# EAGLE design tractor_panel_1v0 (EAGLE 9.5.2)
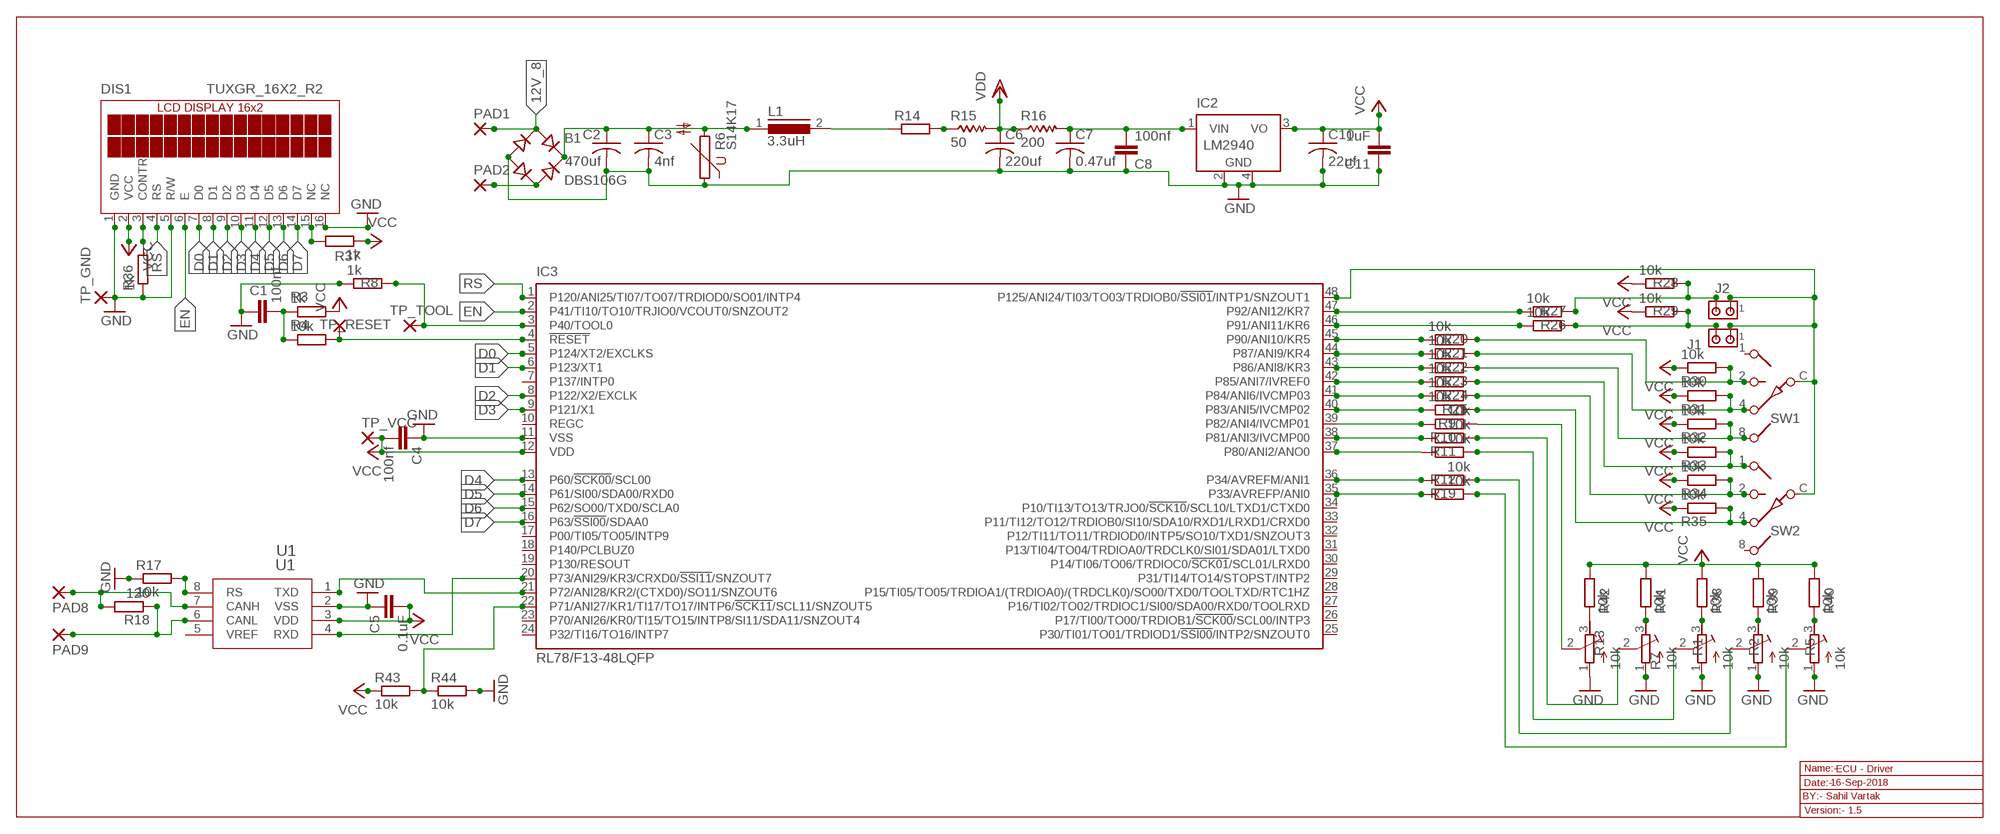
[diagram p0: schematic, sheet 1]

## Parts
B1  DBS106G  [DBS]
C1  100nf  CC0603  [C0603]
C2  470uf  C-US050-075X075  [C050-075X075]
C3  4nf  C-US050-045X075  [C050-045X075]
C4  100nf  CC0603  [C0603]
C5  0.1uF  CC0603  [C0603]
C6  220uf  C-US025-025X050  [C025-025X050]
C7  0.47uf  C-US025-025X050  [C025-025X050]
C8  100nf  CC0603  [C0603]
C10  22uf  C-US025-025X050  [C025-025X050]
C11  1uF  CC0603  [C0603]
DIS1  TUXGR_16X2_R2  [TUXGR_16X2_R2]
IC2  LM2940  LM2936MP-3.0  [SOT223]
IC3  RL78/F13-48LQFP  [P-LFQFP48-7X7]
J1  MTA02-156  [1X2MTA]
J2  MTA02-156  [1X2MTA]
L1  3.3uH  82114R  [82114R]
PAD1  2,54/1,1  [2,54/1,1]
PAD2  2,54/1,1  [2,54/1,1]
PAD8  2,54/1,1  [2,54/1,1]
PAD9  2,54/1,1  [2,54/1,1]
R1  10k  R-TRIMM3296W  [RTRIM3296W]
R2  10k  R-TRIMM3296W  [RTRIM3296W]
R3  1k  RR0603  [R0603]
R4  10k  RR0603  [R0603]
R5  10k  R-TRIMM3296W  [RTRIM3296W]
R6  S14K17  [S14K17]
R7  10k  R-TRIMM3296W  [RTRIM3296W]
R8  1k  RR0603  [R0603]
R9  10k  RR0603  [R0603]
R10  10k  RR0603  [R0603]
R11  10k  RR0603  [R0603]
R12  10k  RR0603  [R0603]
R13  10k  R-TRIMM3296W  [RTRIM3296W]
R14  R-EU_R0603  [R0603]
R15  50  R-US_WSC2515  [WSC2515]
R16  200  R-US_WSC2515  [WSC2515]
R17  10k  RR0603  [R0603]
R18  120  RR0603  [R0603]
R19  10k  RR0603  [R0603]
R20  10k  RR0603  [R0603]
R21  10k  RR0603  [R0603]
R22  10k  RR0603  [R0603]
R23  10k  RR0603  [R0603]
R24  10k  RR0603  [R0603]
R25  10k  RR0603  [R0603]
R26  10k  RR0603  [R0603]
R27  10k  RR0603  [R0603]
R28  10k  RR0603  [R0603]
R29  10k  RR0603  [R0603]
R30  10k  RR0603  [R0603]
R31  10k  RR0603  [R0603]
R32  10k  RR0603  [R0603]
R33  10k  RR0603  [R0603]
R34  10k  RR0603  [R0603]
R35  10k  RR0603  [R0603]
R36  1k  RR0603  [R0603]
R37  1k  RR0603  [R0603]
R38  10k  RR0603  [R0603]
R39  10k  RR0603  [R0603]
R40  10k  RR0603  [R0603]
R41  10k  RR0603  [R0603]
R42  10k  RR0603  [R0603]
R43  10k  RR0603  [R0603]
R44  10k  RR0603  [R0603]
SW1  SW-C10  [SW-C10]
SW2  SW-C10  [SW-C10]
TP_GND  1,6/0,8  [1,6/0,8]
TP_RESET  1,6/0,8  [1,6/0,8]
TP_TOOL  1,6/0,8  [1,6/0,8]
TP_VCC  1,6/0,8  [1,6/0,8]
U1  U1  MCP2551-I/SNSOIC8-N_MC-M  [SOIC8-N_MC-M]

## Nets
12V_8: B1.AC1 PAD1.1(P)
D0: DIS1.7(D0) IC3.5(P124/XT2/EXCLKS)
D1: DIS1.8(D1) IC3.6(P123/XT1)
D2: DIS1.9(D2) IC3.8(P122/X2/EXCLK)
D3: DIS1.10(D3) IC3.9(P121/X1)
D4: DIS1.11(D4) IC3.13(P60/!SCK00!/SCL00)
D5: DIS1.12(D5) IC3.14(P61/SI00/SDA00/RXD0)
D6: DIS1.13(D6) IC3.15(P62/SO00/TXD0/SCLA0)
D7: DIS1.14(D7) IC3.16(P63/!SSI00!/SDAA0)
EN: DIS1.6(E) IC3.2(P41/TI10/TO10/TRJIO0/VCOUT0/SNZOUT2)
GND: B1.- C1.1 C2.2 C3.2 C4.1 C5.1 C6.2 C7.2 C8.1 C10.2 C11.1 DIS1.1(GND) DIS1.5(R/W) DIS1.16(NC) IC2.2(GND) IC2.4(GND) IC3.11(VSS) R1.1(A) R2.1(A) R5.1(A) R6.1 R7.1(A) R8.1 R13.1(A) R17.1 R36.1 R44.2 TP_GND.1(P) U1.2(VSS)
N$1: B1.AC2 PAD2.1(P)
N$2: IC3.22(P71/ANI27/KR1/TI17/TO17/INTP6/!SCK11!/SCL11/SNZOUT5) R43.2 R44.1
N$3: L1.2 R14.1
N$4: R5.2(S) R19.1
N$5: R2.2(S) R12.1
N$6: IC3.45(P90/ANI10/KR5) R20.1
N$7: C7.1 C8.2 IC2.1(VIN) R16.2
N$8: DIS1.3(CONTR) R36.2
N$9: DIS1.15(NC) R37.2
N$10: IC3.46(P91/ANI11/KR6) R26.1
N$11: IC3.47(P92/ANI12/KR7) R27.1
N$12: IC3.44(P87/ANI9/KR4) R21.1
N$13: R1.3(E) R38.1
N$14: R2.3(E) R39.1
N$15: R14.2 R15.1
N$16: R5.3(E) R40.1
N$17: R7.3(E) R41.1
N$18: R13.3(E) R42.1
N$19: IC3.48(P125/ANI24/TI03/TO03/TRDIOB0/!SSI01!/INTP1/SNZOUT1) J1.1 J2.1 SW1.C SW2.C
N$27: B1.+ C2.1 C3.1 L1.1 R6.2
N$28: IC3.43(P86/ANI8/KR3) R22.1
N$29: IC3.42(P85/ANI7/IVREF0) R23.1
N$30: PAD9.1(P) R18.1 U1.6(CANL)
N$31: PAD8.1(P) R18.2 U1.7(CANH)
N$32: IC3.20(P73/ANI29/KR3/CRXD0/!SSI11!/SNZOUT7) U1.4(RXD)
N$33: IC3.41(P84/ANI6/IVCMP03) R24.1
N$34: R17.2 U1.8(RS)
N$35: J2.2 R27.2 R28.2
N$36: IC3.40(P83/ANI5/IVCMP02) R25.1
N$37: IC3.39(P82/ANI4/IVCMP01) R9.2
N$38: R21.2 R31.2 SW1.4
N$39: IC3.38(P81/ANI3/IVCMP00) R10.2
N$40: IC3.37(P80/ANI2/ANO0) R11.2
N$41: IC3.36(P34/AVREFM/ANI1) R12.2
N$42: IC3.35(P33/AVREFP/ANI0) R19.2
N$43: R20.2 R30.2 SW1.2
N$44: IC3.21(P72/ANI28/KR2/(CTXD0)/SO11/SNZOUT6) U1.1(TXD)
N$45: R22.2 R32.2 SW1.8
N$46: R23.2 R33.2 SW2.1
N$47: R24.2 R34.2 SW2.2
N$48: R25.2 R35.2 SW2.4
N$52: J1.2 R26.2 R29.2
N$57: R9.1 R13.2(S)
N$58: R7.2(S) R10.1
N$59: R1.2(S) R11.1
N$62: C1.2 R3.1 R4.1
N$64: IC3.3(P40/TOOL0) R8.2 TP_TOOL.1(P)
N$110: IC3.4(!RESET) R4.2 TP_RESET.1(P)
RS: DIS1.4(RS) IC3.1(P120/ANI25/TI07/TO07/TRDIOD0/SO01/INTP4)
VCC: C4.2 C5.2 C10.1 C11.2 DIS1.2(VCC) IC2.3(VO) IC3.12(VDD) R3.2 R28.1 R29.1 R30.1 R31.1 R32.1 R33.1 R34.1 R35.1 R37.1 R38.2 R39.2 R40.2 R41.2 R42.2 R43.1 TP_VCC.1(P) U1.3(VDD)
VDD: C6.1 R15.2 R16.1
Unconnected: IC3.7(P137/INTP0) IC3.10(REGC) IC3.17(P00/TI05/TO05/INTP9) IC3.18(P140/PCLBUZ0) IC3.19(P130/RESOUT) IC3.23(P70/ANI26/KR0/TI15/TO15/INTP8/SI11/SDA11/SNZOUT4) IC3.24(P32/TI16/TO16/INTP7) IC3.25(P30/TI01/TO01/TRDIOD1/!SSI00!/INTP2/SNZOUT0) IC3.26(P17/TI00/TO00/TRDIOB1/!SCK00!/SCL00/INTP3) IC3.27(P16/TI02/TO02/TRDIOC1/SI00/SDA00/RXD0/TOOLRXD) IC3.28(P15/TI05/TO05/TRDIOA1/(TRDIOA0)/(TRDCLK0)/SO00/TXD0/TOOLTXD/RTC1HZ) IC3.29(P31/TI14/TO14/STOPST/INTP2) IC3.30(P14/TI06/TO06/TRDIOC0/!SCK01!/SCL01/LRXD0) IC3.31(P13/TI04/TO04/TRDIOA0/TRDCLK0/SI01/SDA01/LTXD0) IC3.32(P12/TI11/TO11/TRDIOD0/INTP5/SO10/TXD1/SNZOUT3) IC3.33(P11/TI12/TO12/TRDIOB0/SI10/SDA10/RXD1/LRXD1/CRXD0) IC3.34(P10/TI13/TO13/TRJO0/!SCK10!/SCL10/LTXD1/CTXD0) SW1.1 SW2.8 U1.5(VREF)

## Notes on the sheet
- Name:- | ECU - Driver
- Date:- | 16-Sep-2018
- BY:- Sahil Vartak
- Version:- 1.5

## Library data of the parts
B1 = rectifier:DB?*G: Single Phase 1.0 AMP Glass Passivated Bridge Rectifier Taiwan Semiconductor Co.,Ltd. - TSC Source: http://www.taiwansemi.com/TSCbig5/ezcatfiles/cust/img/img/db101g.pdf http://www.ts.com.tw/db/pictures/modules/PDT/PDT060207001/DBLS201G.pdf
C1 C4 C5 C8 C11 = eagle-ltspice:C: CAPACITOR, European symbol; SPICEMODEL: NONE; SPICEPREFIX: C
C2 = resistor:C-US: CAPACITOR, American symbol
C3 C6 C7 C10 = rcl:C-US: CAPACITOR, American symbol
DIS1 = display-lcd:TUXGR_16X2_R2: Tuxgraphics LCD display 16x2 characters reflective, without background light Source: tuxgr_12x2_r2.pdf; OC_FARNELL: unknown; OC_NEWARK: unknown
IC2 = national-semiconductor:LM2936MP?*: Ultra-Low Quiescent Current LDO Voltage Regulator Source: Data sheet <http://www.national.com/ds/LM/LM2936.pdf>; MF: NATIONAL SEMICONDUCTOR; MPN: LM2936MP-3.0/NOPB; OC_FARNELL: 1496125; OC_NEWARK: 41K4522
IC3 = micro-renesas:RL78/F13-48: 16-Bit Single-Chip Microcontroller Source: Data sheet <http://documentation.renesas.com/doc/products/mpumcu/doc/rl78/r01uh0368ej0200_rl78f13_14.pdf>
J1 J2 = con-amp:MTA02-156: AMP connector
L1 = inductors:82114R: INDUCTOR; SPICEPREFIX: L
PAD1 PAD2 PAD8 PAD9 = wirepad:2,54/1,1: THROUGH-HOLE PAD
R1 R2 R5 R7 R13 = rcl:R-TRIMM: Trimm resistor; SPICEMODEL: X; SPICEPREFIXL: POT
R3 R4 R8-R12 R17-R44 = eagle-ltspice:R: RESISTOR, European symbol; SPICEMODEL: NONE; SPICEPREFIX: R
R6 = varistor:S14K17: VARISTOR
R14 = resistor:R-EU_: RESISTOR, European symbol
R15 R16 = resistor:R-US_: RESISTOR, American symbol
SW1 SW2 = special:SW-C10: SWITCH 10-step rotary switch
TP_GND TP_RESET TP_TOOL TP_VCC = wirepad:1,6/0,8: THROUGH-HOLE PAD
U1 = mcp2551:MCP2551-I/SN; BUILT_BY: EMA_UL_Team; MANUFACTURER_PART_NUMBER: MCP2551-I/SN; VENDOR: Microchip

## Board
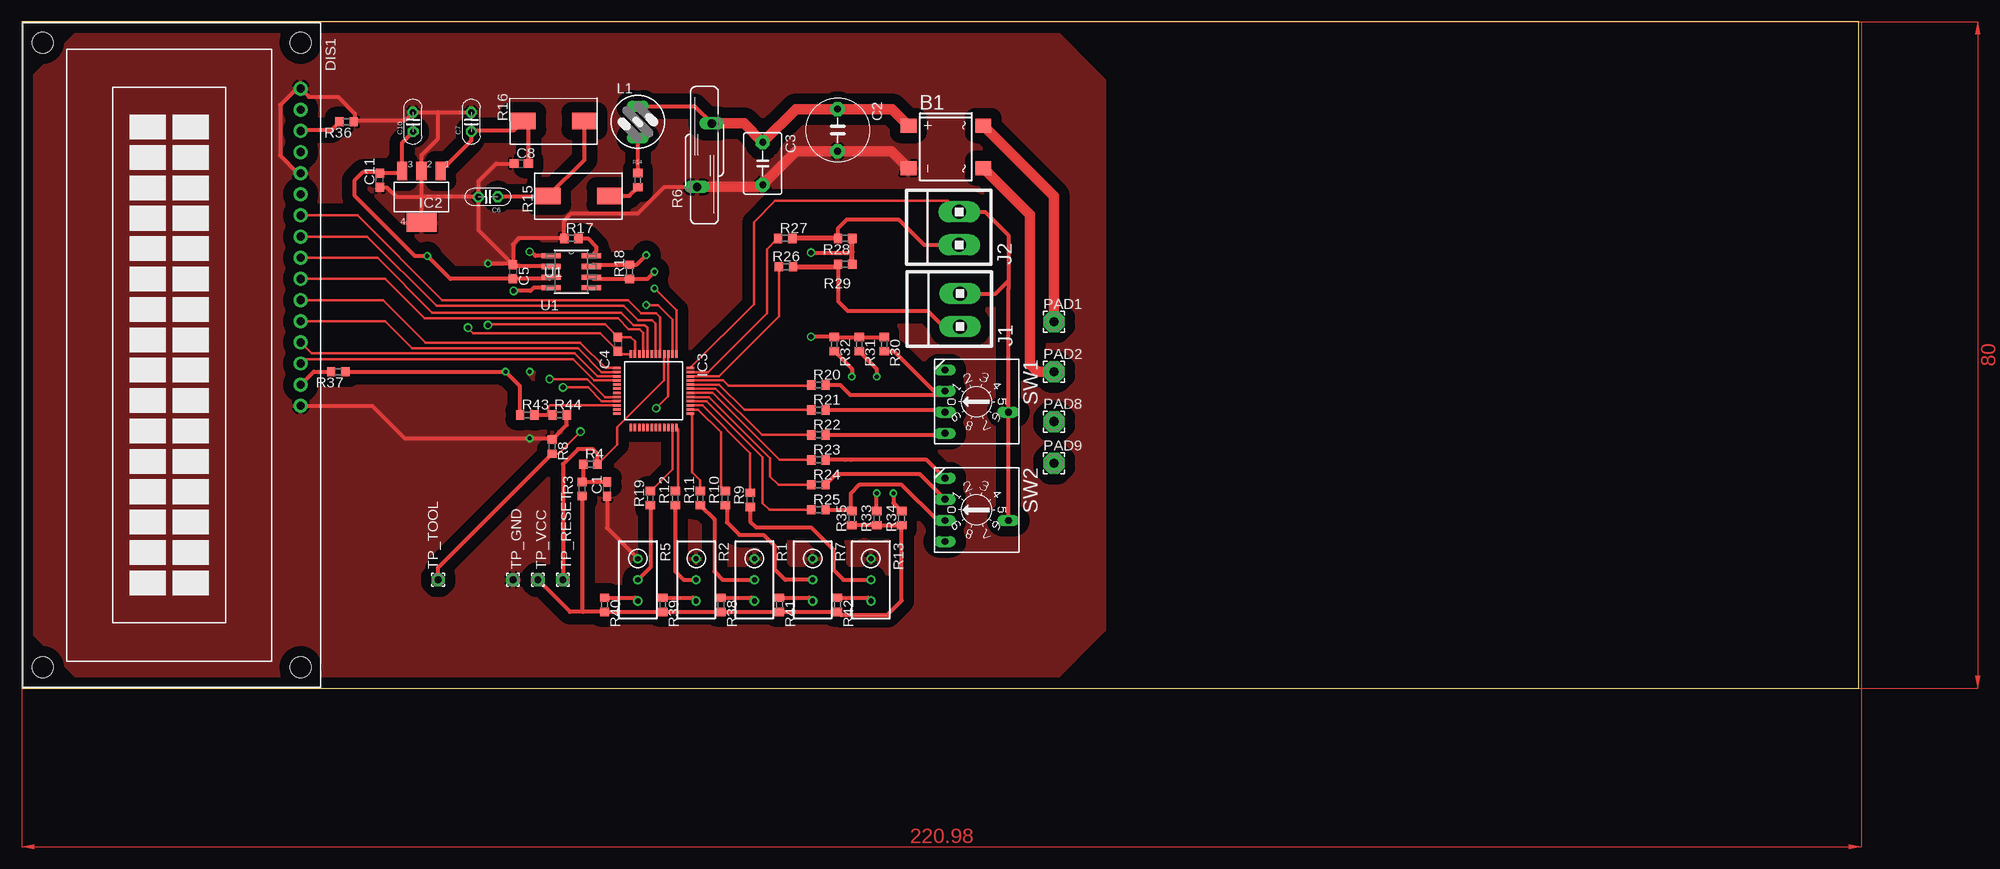
[diagram p1: board, top side]
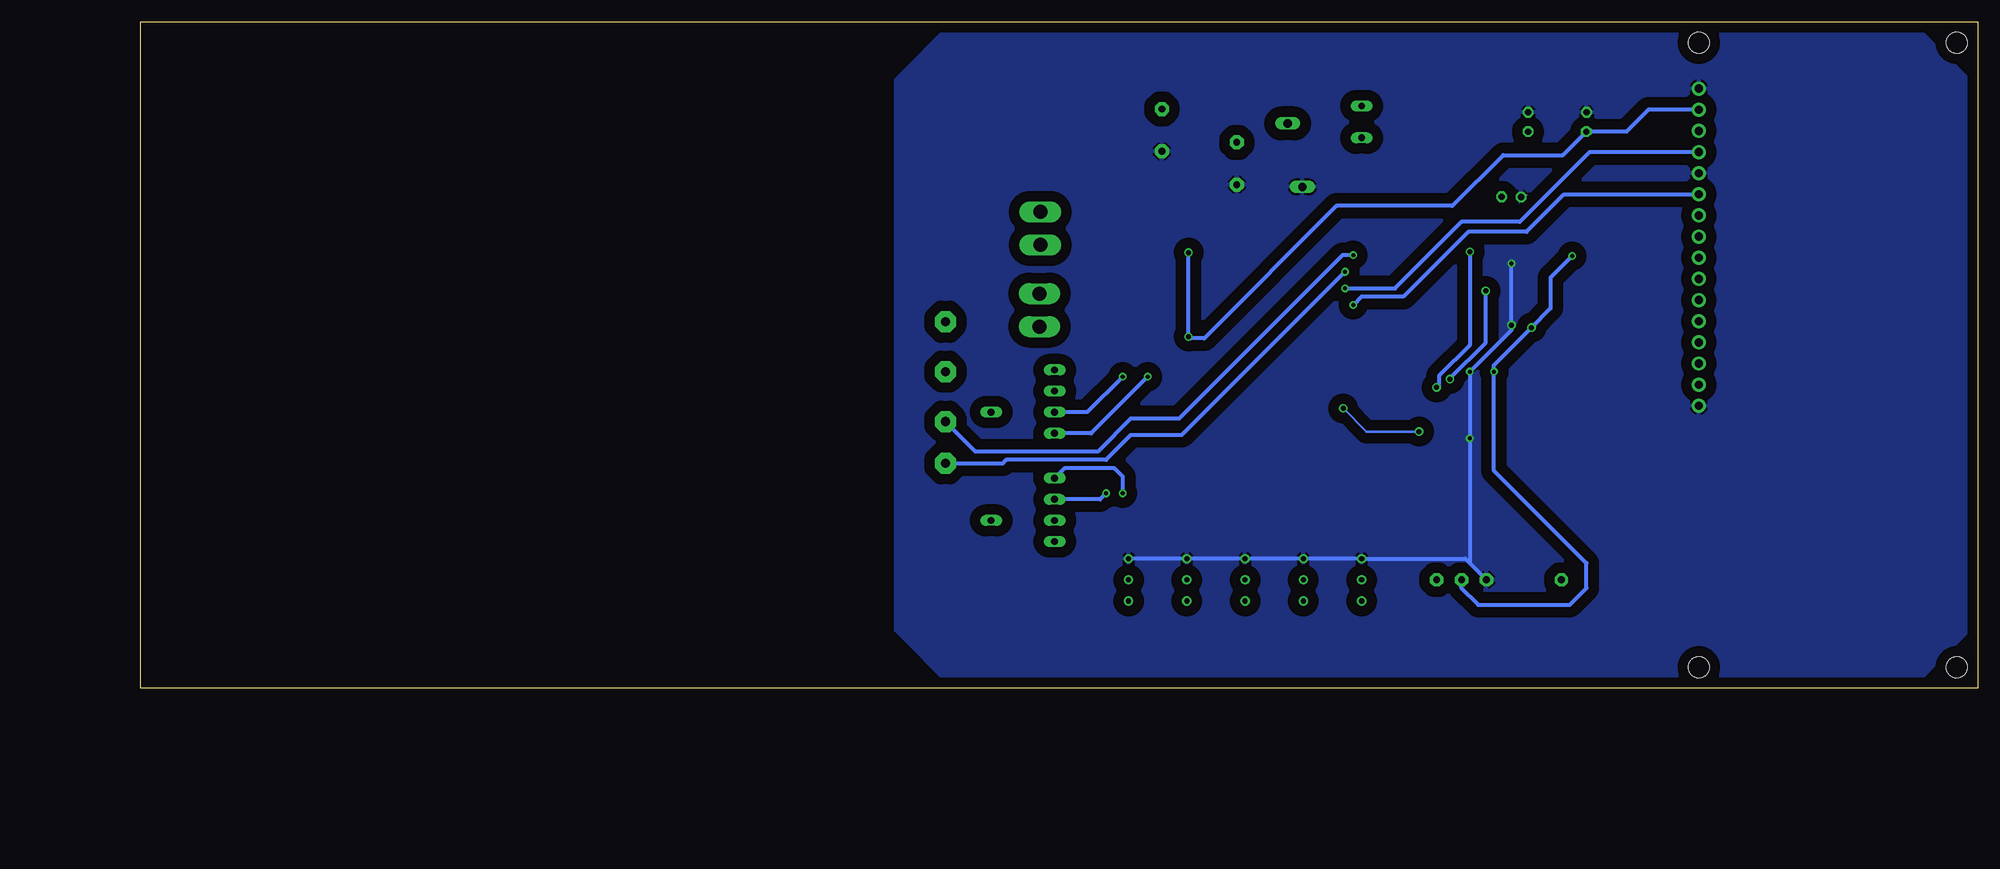
[diagram p2: board, bottom side, seen from below]

Size 220.65 x 80 mm. Coordinates in mm from the lower left corner, seen from the top.
Outline: 0,0 220.65,0 220.65,80 0,80 0,0
Copper layers (1*16): Top 0.035mm / dielectric 1.5mm / Bottom 0.035mm
Design rules "default": minimum track width 6mil, minimum drill 0.35mm, track to track 6mil, track to pad 6mil, pad to pad 6mil, via to via 6mil, smd to smd 6mil, copper to edge 40mil, drill to drill 6mil, minimum pad ring 10mil, minimum via ring 8mil, stop-mask expansion 4mil, vias tented up to drill 0mil, thermal gap 10mil

### Footprints (pad centres in the part's own frame; a part is rotated, then mirrored left to right if it is on the bottom)
DBS = smd 1.7 x 1.9: + -2.55,-4.5; - 2.55,-4.5; AC1 -2.55,4.5; AC2 2.55,4.5
C0603 = smd 1.1 x 1: 1 -0.85,0; 2 0.85,0
C050-075X075 = drill 0.813 pad 1.676 octagon: 1 -2.54,0; 2 2.54,0
C050-045X075 = drill 0.813 pad 1.676 octagon: 1 -2.54,0; 2 2.54,0
C025-025X050 = drill 0.762 pad 1.27 octagon: 1 -1.176,-0.006; 2 1.159,0.007
TUXGR_16X2_R2 = drill 1 pad 1.676: 1 -32,15.5; 2 -29.46,15.5; 3 -26.92,15.5; 4 -24.38,15.5; 5 -21.84,15.5; 6 -19.3,15.5; 7 -16.76,15.5; 8 -14.22,15.5; 9 -11.68,15.5; 10 -9.14,15.5; 11 -6.6,15.5; 12 -4.06,15.5; 13 -1.52,15.5; 14 1.02,15.5; 15 3.56,15.5; 16 6.1,15.5 | hole 2.5: -37.5,-15.5; 37.5,-15.5; -37.5,15.5; 37.5,15.5
SOT223 = smd 1.219 x 2.235: 1 -2.311,-3.099; 2 0,-3.099; 3 2.311,-3.099 | smd 3.6 x 2.2: 4 0,3.099
P-LFQFP48-7X7 = smd 0.9 x 0.3: 1 -4.4,2.75; 2 -4.4,2.25; 3 -4.4,1.75; 4 -4.4,1.25; 5 -4.4,0.75; 6 -4.4,0.25; 7 -4.4,-0.25; 8 -4.4,-0.75; 9 -4.4,-1.25; 10 -4.4,-1.75; 11 -4.4,-2.25; 12 -4.4,-2.75; 25 4.4,-2.75; 26 4.4,-2.25; 27 4.4,-1.75; 28 4.4,-1.25; 29 4.4,-0.75; 30 4.4,-0.25; 31 4.4,0.25; 32 4.4,0.75; 33 4.4,1.25; 34 4.4,1.75; 35 4.4,2.25; 36 4.4,2.75 | smd 0.3 x 0.9: 13 -2.75,-4.4; 14 -2.25,-4.4; 15 -1.75,-4.4; 16 -1.25,-4.4; 17 -0.75,-4.4; 18 -0.25,-4.4; 19 0.25,-4.4; 20 0.75,-4.4; 21 1.25,-4.4; 22 1.75,-4.4; 23 2.25,-4.4; 24 2.75,-4.4; 37 2.75,4.4; 38 2.25,4.4; 39 1.75,4.4; 40 1.25,4.4; 41 0.75,4.4; 42 0.25,4.4; 43 -0.25,4.4; 44 -0.75,4.4; 45 -1.25,4.4; 46 -1.75,4.4; 47 -2.25,4.4; 48 -2.75,4.4
1X2MTA = drill 1.676 long: 1 1.981,0; 2 -1.981,0
82114R = drill 0.813 long: 1 0,1.905; 2 0,-1.905
2,54/1,1 = drill 1.118 pad 2.54 octagon: 1 0,0
RTRIM3296W = drill 0.61: 1 0,-2.54; 2 0,0; 3 0,2.54
R0603 = smd 1 x 1.1: 1 -0.85,0; 2 0.85,0
S14K17 = drill 1.016 long: 1 -0.889,-3.81; 2 0.889,3.81
WSC2515 = smd 3 x 2: 1 -3.575,-0.1; 2 3.775,-0.1
SW-C10 = drill 0.813 long: 1 -3.81,-3.81; 2 -1.27,-3.81; 4 1.27,-3.81; 8 3.81,-3.81; C 1.27,3.81
1,6/0,8 = drill 0.813 pad 1.6 octagon: 1 0,0
SOIC8-N_MC-M = smd 2.286 x 0.61: 1 -2.413,1.905; 2 -2.413,0.635; 3 -2.413,-0.635; 4 -2.413,-1.905; 5 2.413,-1.905; 6 2.413,-0.635; 7 2.413,0.635; 8 2.413,1.905

### Placement (x,y rotation side)
B1  111,65 270 top
C1  70.3,23.9 90 top
C2  98,67 270 top
C3  89,63 270 top
C4  71.6,41.3 270 top
C5  59,50 270 top
C6  56,59 180 top
C7  54,68 90 top
C8  60,63 0 top
C10  47,68 90 top
C11  43,61 90 top
DIS1  18,40 270 top
IC2  48,59 180 top
IC3  75.9,35.7 270 top
J1  112.7,45.4 90 top
J2  112.6,55.2 90 top
L1  74,68 0 top
PAD1  124,44 0 top
PAD2  124,38 0 top
PAD8  124,32 0 top
PAD9  124,27 0 top
R1  88,13 180 top
R2  81,13 180 top
R3  67.3,23.9 270 top
R4  68.3,26.9 0 top
R5  74,13 180 top
R6  82,64 0 top
R7  95,13 180 top
R8  63.7,29 270 top
R9  87.5,22.6 90 top
R10  84.5,22.8 90 top
R11  81.5,22.8 90 top
R12  78.5,22.8 90 top
R13  102,13 180 top
R14  74,61 270 top
R15  67,59 180 top
R16  64,68 180 top
R17  66,54 0 top
R18  73,50 90 top
R19  75.5,22.8 90 top
R20  95.7,36.4 0 top
R21  95.7,33.4 0 top
R22  95.7,30.4 0 top
R23  95.7,27.4 0 top
R24  95.7,24.4 0 top
R25  95.7,21.4 0 top
R26  91.8,50.6 0 top
R27  91.7,54 0 top
R28  98.9,54 180 top
R29  98.9,50.9 180 top
R30  103.6,41.3 270 top
R31  100.6,41.3 270 top
R32  97.6,41.3 270 top
R33  102.7,20.4 90 top
R34  105.7,20.4 90 top
R35  99.7,20.4 90 top
R36  39,68 180 top
R37  38,38 180 top
R38  84,10 270 top
R39  77,10 270 top
R40  70,10 270 top
R41  91,10 270 top
R42  98,10 270 top
R43  60.7,32.8 0 top
R44  64.6,32.8 0 top
SW1  114.7,34.4 270 top
SW2  114.7,21.4 270 top
TP_GND  59,13 0 top
TP_RESET  65,13 0 top
TP_TOOL  50,13 90 top
TP_VCC  62,13 0 top
U1  66,50 0 top

### Tracks (layer width: path | path; a pad name or v marks a point on that pad's centre or on a via)
12V_8
  Top 1.27: B1.AC1 124,59.05 PAD1.1
D0
  Top 0.305: IC3.5 76.65,44.55 76.2,45 74.4,45 72.8,46.6 50.5,46.6 40.34,56.76 DIS1.7
D1
  Top 0.305: DIS1.8 41.48,54.22 49.8,45.9 72.3,45.9 74,44.2 75.7,44.2 76.15,43.75 IC3.6
D2
  Top 0.305: DIS1.9 42.72,51.68 49.3,45.1 72,45.1 73.5,43.6 74.8,43.6 75.15,43.25 IC3.8
D3
  Top 0.305: IC3.9 74.65,42.65 74.2,43.1 72.9,43.1 71.6,44.4 48.4,44.4 43.66,49.14 DIS1.10
D4
  Top 0.305: IC3.13 70.1,38.45 67.05,41.5 48.5,41.5 43.4,46.6 DIS1.11
D5
  Top 0.305: DIS1.12 43.64,44.06 46.9,40.8 66.8,40.8 69.65,37.95 IC3.14
D6
  Top 0.305: IC3.15 69.15,37.45 66.4,40.2 34.82,40.2 DIS1.13
D7
  Top 0.305: DIS1.14 34.02,39.5 66.2,39.5 68.75,36.95 IC3.16
EN  (via drill 0.5)
  Top 0.305: IC3.2 78.15,44.25 76.4,46 v75,46
  Bottom 0.508: v75,46 74,47 69,47 61.2,54.8 54.2,54.8 49.7,59.3 DIS1.6
GND  (via drill 0.5, 0.6 pad 0.65)
  Top 0.305: IC3.11 73.65,41.65 73.15,42.15 C4.1 70.05,43.7 56,43.7 v56,43.59
  Top 0.508: U1.2 59.22,50.63 C5.1 | C5.1 59,53.3 59.7,54 R17.1 65.15,56.15 66,57 74,57 77.19,60.19 R6.1 | 50,69.16 C10.2 45.98,68.15 40,68.15 | 50,69.16 C7.2 | IC2.4 48,59 | 48,59 IC2.2 48,64 50,66 50,69.16 | 40,68.15 R36.1 | DIS1.5 33.16,61.84 31,64 31,70 33,72 DIS1.1 34.5,71 38,71 40,69 40,68.15 | C5.1 54.84,55.01 C6.2 | C6.2 54.84,60.84 57,63 C8.1 | C11.1 43.85,60.15 45,59 48,59 | 48,59 48.01,58.99 C6.2 | C1.1 70.3,19.24 R5.1 | DIS1.16 42.1,33.9 46,30 v61,30 63.55,30 R8.1 65.45,31.6 R44.2 | v56,51 58.85,51 C5.1
  Top 1.27: B1.- 104.5,64.45 96.01,64.45 | 96.01,64.45 96.02,64.46 C2.2 | R6.1 88.73,60.19 C3.2 92.99,64.45 96.01,64.45
  Bottom 0.508: R13.1 R7.1 R1.1 R2.1 R5.1 61.54,15.54 TP_GND.1 61,15 v61,30 v61,38 56,43 v56,43.59 v56,51
  pour Top (isolate 1.27): 0,72 8,80 123,80 130,73 130,7 123,0 8,0 0,8
  pour Bottom (isolate 1.27): 8,80 123,80 130,73 130,7 123,0 8,0 0,8 0,72
N$1
  Top 1.27: B1.AC2 121.1,56.85 121.1,38.9 122,38 PAD2.1
N$2
  Top 0.305: IC3.22 63.45,33.95 63.2,33.7 63.2,32.9 63.3,32.8
  Top 0.508: R43.2 63.3,32.8 R44.1
N$3
  Top 0.508: R14.1 L1.2
N$4
  Top 0.508: R19.1 75.5,14.5 R5.2
N$5
  Top 0.508: R12.1 78.5,14 79.5,13 R2.2
N$6
  Top 0.305: IC3.45 84.25,36.95 84.9,36.3 94.75,36.3 R20.1
N$7
  Top 0.508: IC2.1 54.01,65.79 C7.1 54.18,67 59.12,67 60.06,67.94 | 60.06,67.94 R16.2 | C8.2 60.85,67.15 60.06,67.94
N$8
  Top 0.508: DIS1.3 33.58,67 37.15,67 R36.2
N$9
  Top 0.508: DIS1.15 35.06,38 R37.2
N$10
  Top 0.305: IC3.46 83.75,37.45 90.95,44.65 R26.1
N$11
  Top 0.305: IC3.47 82.45,37.95 89.5,45 89.5,52.7 90.8,54 R27.1
N$12
  Top 0.305: IC3.44 83.75,36.45 86.8,33.4 R21.1
N$13
  Top 0.508: R38.1 87.61,10.85 R1.3
N$14
  Top 0.508: R39.1 80.61,10.85 R2.3
N$15
  Top 0.508: R15.1 72.95,59.1 R14.2
N$16
  Top 0.508: R40.1 73.61,10.85 R5.3
N$17
  Top 0.508: R41.1 94.61,10.85 R7.3
N$18
  Top 0.508: R42.1 101.61,10.85 R13.3
N$19
  Top 0.305: IC3.48 87.97,46.12 87.97,55.98 90.5,58.5 111.28,58.5 J2.1
  Top 0.508: SW2.C SW1.C 118.51,47.89 118.5,47.9 118.5,48.9 | J2.1 115.72,57.18 118.5,54.4 118.5,48.9 | 118.5,48.9 116.9,47.3 112.78,47.3 J1.1
N$27
  Top 0.508: L1.1 80.79,69.91 R6.2
  Top 1.27: B1.+ 104.51,69.54 C2.1 93,69.54 C3.1 86.73,67.81 R6.2
N$28
  Top 0.305: IC3.43 83.35,35.95 88.9,30.4 R22.1
N$29
  Top 0.305: IC3.42 82.95,35.45 91,27.4 R23.1
N$30  (via drill 0.5)
  Top 0.508: U1.6 68.63,49.15 R18.1 75.15,49.15 v76,50
  Bottom 0.508: v76,50 95.6,30.4 101.7,30.4 104.7,27.4 116.7,27.4 117.1,27 PAD9.1
N$31  (via drill 0.5)
  Top 0.508: U1.7 68.63,50.85 R18.2 73.85,50.85 v75,52
  Bottom 0.508: v75,52 76.3,52 95.9,32.4 101.7,32.4 105.7,28.4 120.4,28.4 PAD8.1
N$32  (via drill 0.6 pad 0.65)
  Top 0.305: IC3.20 70.05,34.95 67.9,37.1 v63.4,37.1
  Top 0.508: U1.4 61.49,48.09 61.1,47.7 v59.1,47.7
  Bottom 0.508: v63.4,37.1 63.4,37.2 59.1,41.5 v59.1,47.7
N$33
  Top 0.305: IC3.41 82.55,34.95 89.9,27.6 89.9,25.4 90.9,24.4 R24.1
N$34
  Top 0.508: R17.2 68,54 69,53 69,52.49 U1.8
N$35
  Top 0.508: R28.2 98.05,55.25 99.1,56.3 105.3,56.3 108.38,53.22 J2.2
  Top 0.61: R28.2 R27.2
N$36
  Top 0.305: IC3.40 82.25,34.45 89,27.7 89,22.2 89.8,21.4 R25.1
N$37
  Top 0.305: IC3.39 81.75,33.95 87.5,28.2 R9.2
N$38  (via drill 0.5)
  Top 0.508: R31.2 102.7,38.35 v102.7,37.4 | R21.2 110.62,33.4 SW1.4
  Bottom 0.508: v102.7,37.4 106.97,33.13 SW1.4
N$39
  Top 0.305: IC3.38 81.25,33.45 84,30.7 84,24.15 R10.2
N$40
  Top 0.305: R11.2 81.5,24.95 80.5,25.95 80.5,32.75 IC3.37
N$41
  Top 0.305: IC3.36 78.85,31.1 78.85,24 R12.2
N$42
  Top 0.305: IC3.35 78.15,26.3 R19.2
N$43
  Top 0.508: R30.2 104.8,40.45 109.58,35.67 SW1.2 110.42,35.2 99.5,35.2 98.3,36.4 R20.2
N$44  (via drill 0.6 pad 0.65)
  Top 0.305: IC3.21 69.65,34.45 68,36.1 v65,36.1
  Top 0.508: U1.1 61.7,51.91 61.2,52.4 v61,52.4
  Bottom 0.508: v61,52.4 61,41.2 64.7,37.5 64.7,36.4 v65,36.1
N$45  (via drill 0.5)
  Top 0.508: R32.2 99.7,38.35 v99.7,37.4 | R22.2 110.7,30.4 SW1.8
  Bottom 0.508: v99.7,37.4 106.51,30.59 SW1.8
N$46  (via drill 0.5)
  Top 0.508: SW2.1 108.69,27.41 99.6,27.41 98.94,27.41 R23.2 | R33.2 v102.7,23.4
  Bottom 0.508: v102.7,23.4 102.7,25.4 103.7,26.4 109.7,26.4 SW2.1
N$47  (via drill 0.5)
  Top 0.508: SW2.2 107.89,25.67 97.82,25.67 R24.2 | v104.7,23.4 104.7,22.25 R34.2
  Bottom 0.508: v104.7,23.4 105.43,22.67 SW2.2
N$48
  Top 0.508: SW2.4 109.97,20.13 105.7,24.4 100.6,24.4 99.55,23.35 99.55,21.4 | R25.2 99.55,21.4 | 99.55,21.4 R35.2
N$52
  Top 0.508: R29.2 98.05,46.45 99.2,45.3 108.82,45.3 110.7,43.42 J1.2
  Top 0.61: R26.2 98.05,50.6 R29.2
N$57
  Top 0.508: R9.1 87.5,20 88.2,19.3 94.8,19.3 97.5,16.6 97.5,14.2 98.7,13 R13.2
N$58
  Top 0.508: R10.1 84.7,21.75 84.7,19.9 86.2,18.4 89.1,18.4 90.4,17.1 90.4,14.3 91.7,13 R7.2
N$59
  Top 0.508: R11.1 83.2,20.25 83.2,14 84.2,13 R1.2
N$62
  Top 0.508: R4.1 67.45,24.9 R3.1 C1.2
N$64  (via drill 0.6 pad 0.65)
  Top 0.305: R8.2 64.45,28.15 v67.1,30.8 | IC3.3 77.65,35.05 v76.2,33.6
  Top 0.508: TP_TOOL.1 50,14.45 R8.2
  Bottom 0.305: v76.2,33.6 73.4,30.8 v67.1,30.8
N$110
  Top 0.305: R4.2 71.5,29.25 71.5,31.3 77.15,36.95 IC3.4
  Top 0.508: R4.2 69.15,28.15 68.6,28.7 66.8,28.7 65,26.9 TP_RESET.1
RS  (via drill 0.5)
  Top 0.305: IC3.1 78.65,45.35 v76,48
  Bottom 0.508: DIS1.4 46.62,64.38 55,56 62,56 70,48 v76,48
VCC  (via drill 0.5, 0.6 pad 0.65)
  Top 0.305: IC3.12 71.95,40.1 C4.2 69.45,42.6 54.2,42.6 53.6,43.2 v53.6,43.3
  Top 0.406: 99.65,52.3 99.75,52.4
  Top 0.508: R30.1 R31.1 R32.1 97.55,42.2 v94.8,42.2 | U1.3 63.37,49.15 C5.2 51.45,49.15 v48.7,51.9 47.2,51.9 40,59.1 40,61 41,62 42.85,62 C11.2 45.44,61.85 IC2.3 45.69,65.51 C10.1 | R35.1 R33.1 R34.1 105.7,10.5 104,8.8 98.35,8.8 R42.2 R41.2 R38.2 R39.2 R40.2 67.4,9.15 | R37.1 v58.1,38 59.85,36.25 R43.1 | 67.4,9.15 65.85,9.15 TP_VCC.1 | R3.2 67.3,9.25 67.4,9.15 | v94.8,52.3 99.65,52.3
  Top 0.61: R29.1 99.75,52.4 R28.1
  Bottom 0.508: DIS1.2 39.54,69.46 42.18,66.82 C10.1 49.83,64 57,64 63.1,57.9 77,57.9 92.9,42 94.6,42 v94.8,42.2 v94.8,52.3 | v48.7,51.9 51.3,49.3 51.3,45.6 v53.6,43.3 58.1,38.8 v58.1,38 58.1,26.1 47,15 47,12 49,10 60,10 62,12 TP_VCC.1
VDD
  Top 0.508: R16.1 67.58,63.45 R15.2 63.13,59.01 C6.1
(copper drawn outside any net)
  shapes: Top area x2